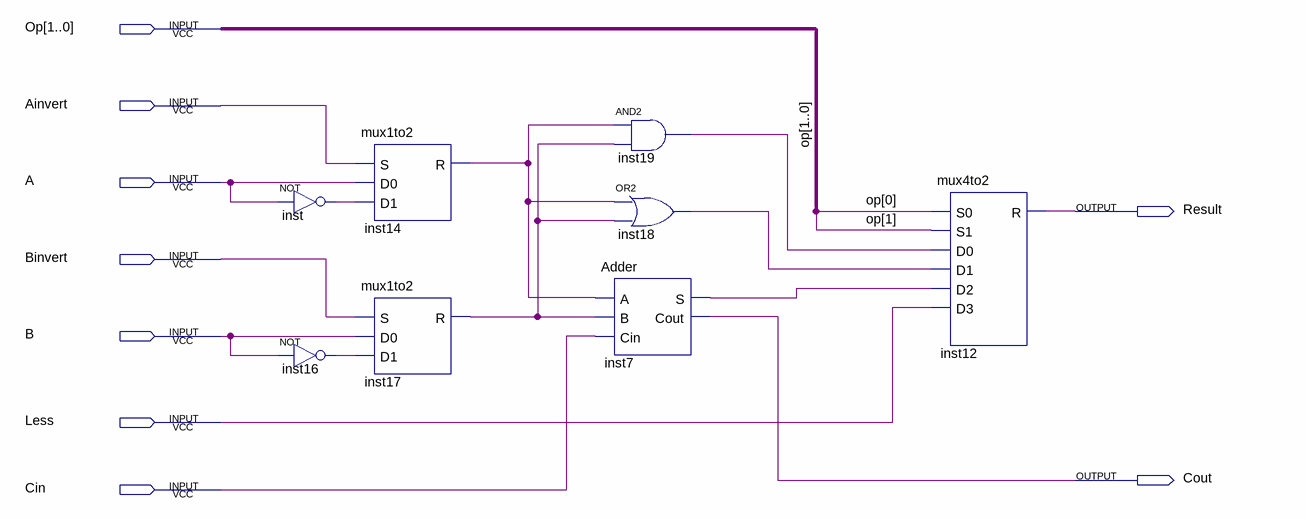
[diagram p0: schematic sheet]
// Quartus schematic ula1bit.bdf as structural Verilog: 8 symbols, 9 pins
module ula1bit (
  input  [1:0] Op,
  input  Ainvert,
  input  A,
  input  Binvert,
  input  B,
  input  Less,
  input  Cin,
  output Result,
  output Cout
);

  wire inst7_s, inst14_r, inst16_out, inst17_r, inst18_out, inst19_out, inst_out;

  not inst (inst_out, A);
  not inst16 (inst16_out, B);
  mux1to2 inst14 (.S(Ainvert), .D0(A), .D1(inst_out), .R(inst14_r));
  mux1to2 inst17 (.S(Binvert), .D0(B), .D1(inst16_out), .R(inst17_r));
  Adder inst7 (.A(inst14_r), .B(inst17_r), .Cin(Cin), .S(inst7_s), .Cout(Cout));
  and inst19 (inst19_out, inst14_r, inst17_r);
  or inst18 (inst18_out, inst14_r, inst17_r);
  mux4to2 inst12 (.S0(Op[0]), .S1(Op[1]), .D0(inst19_out), .D1(inst18_out), .D2(inst7_s), .D3(Less), .R(Result));
endmodule
